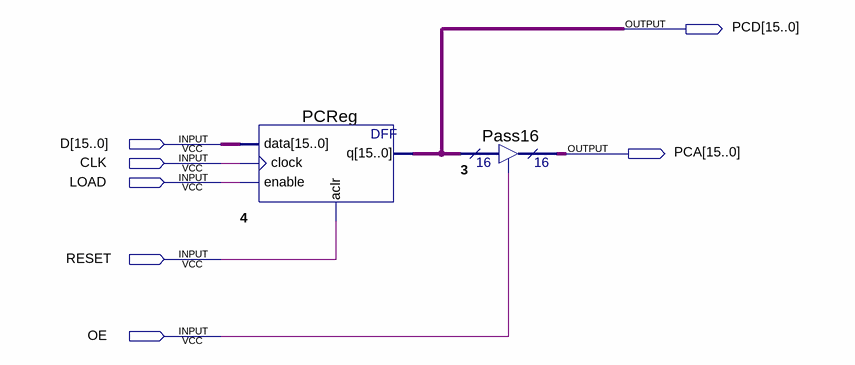
[diagram p0: schematic sheet]
// Quartus schematic programcounter.bdf as structural Verilog: 2 symbols, 7 pins
module programcounter (
  input  [15:0] D,
  input  CLK,
  input  LOAD,
  input  RESET,
  input  OE,
  output [15:0] PCD,
  output [15:0] PCA
);

  PCReg u_4 (.data(D), .clock(CLK), .enable(LOAD), .aclr(RESET), .q(PCD));
  Pass16 u_3 (.enabledt(OE), .data(PCD), .tridata(PCA));
endmodule
